# EAGLE design Phone_EE445L (EAGLE 9.5.1)

## Sheet 1 of 4
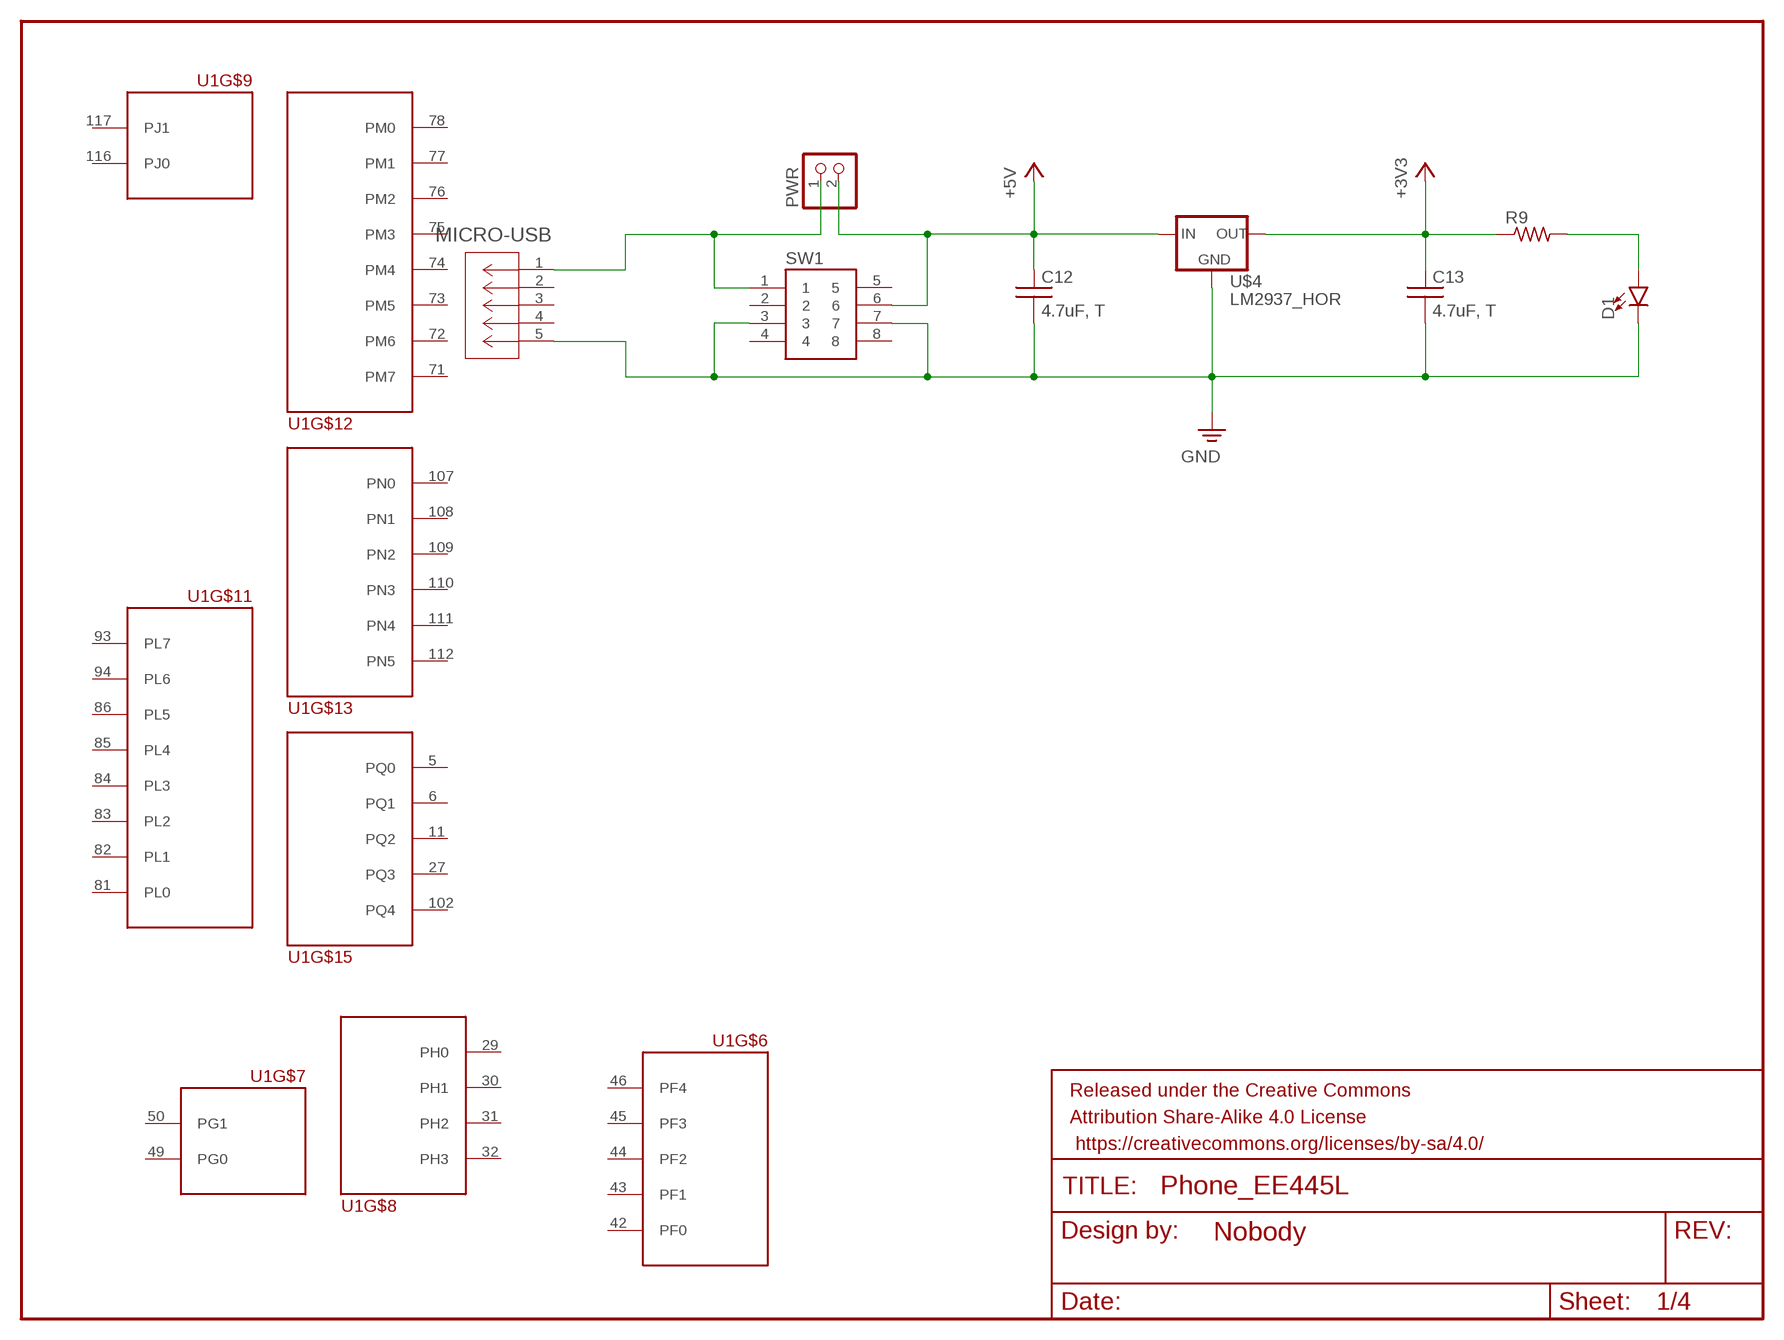
[diagram p0: schematic, sheet 1]

### Parts
C12  4.7uF, T  CAPACITOR050-024X044  [CAP200MIL]
C13  4.7uF, T  CAPACITOR050-024X044  [CAP200MIL]
D1  LED0603  [LED-0603]
FRAME1  FRAME-LETTERNO_PACKAGE  [DUMMY]
MICRO-USB  ZX62D-B-5PA8(30)  [CONN5_ZX62D-B-5PA8]
PWR  PINHD-1X2  [1X02]
R9  R-US_R0805  [R0805]
SW1  PUSHBUTTON  [PWRBUTTON]
U1  TM4C129-MOD  [TQFP-128]
U$4  LM2937_HOR  [TO220]

### Nets
5VIN: MICRO-USB.1 PWR.1 SW1.1
+3V3: C13.1 R9.1 U$4.3(OUT) ; also sheet 2,3,4
+5V: C12.1 PWR.2 SW1.6 U$4.1(IN) ; also sheet 3,4
GND: C12.2 C13.2 D1.C MICRO-USB.5 SW1.3 SW1.7 U$4.2(GND) ; also sheet 2,3,4
N$10: D1.A R9.2
Unconnected: MICRO-USB.2 MICRO-USB.3 MICRO-USB.4 SW1.2 SW1.4 SW1.5 SW1.8 U1.5(PQ0) U1.6(PQ1) U1.11(PQ2) U1.27(PQ3) U1.29(PH0) U1.30(PH1) U1.31(PH2) U1.32(PH3) U1.42(PF0) U1.43(PF1) U1.44(PF2) U1.45(PF3) U1.46(PF4) U1.49(PG0) U1.50(PG1) U1.71(PM7) U1.72(PM6) U1.73(PM5) U1.74(PM4) U1.75(PM3) U1.76(PM2) U1.77(PM1) U1.78(PM0) U1.81(PL0) U1.82(PL1) U1.83(PL2) U1.84(PL3) U1.85(PL4) U1.86(PL5) U1.93(PL7) U1.94(PL6) U1.102(PQ4) U1.107(PN0) U1.108(PN1) U1.109(PN2) U1.110(PN3) U1.111(PN4) U1.112(PN5) U1.116(PJ0) U1.117(PJ1)

## Sheet 2 of 4
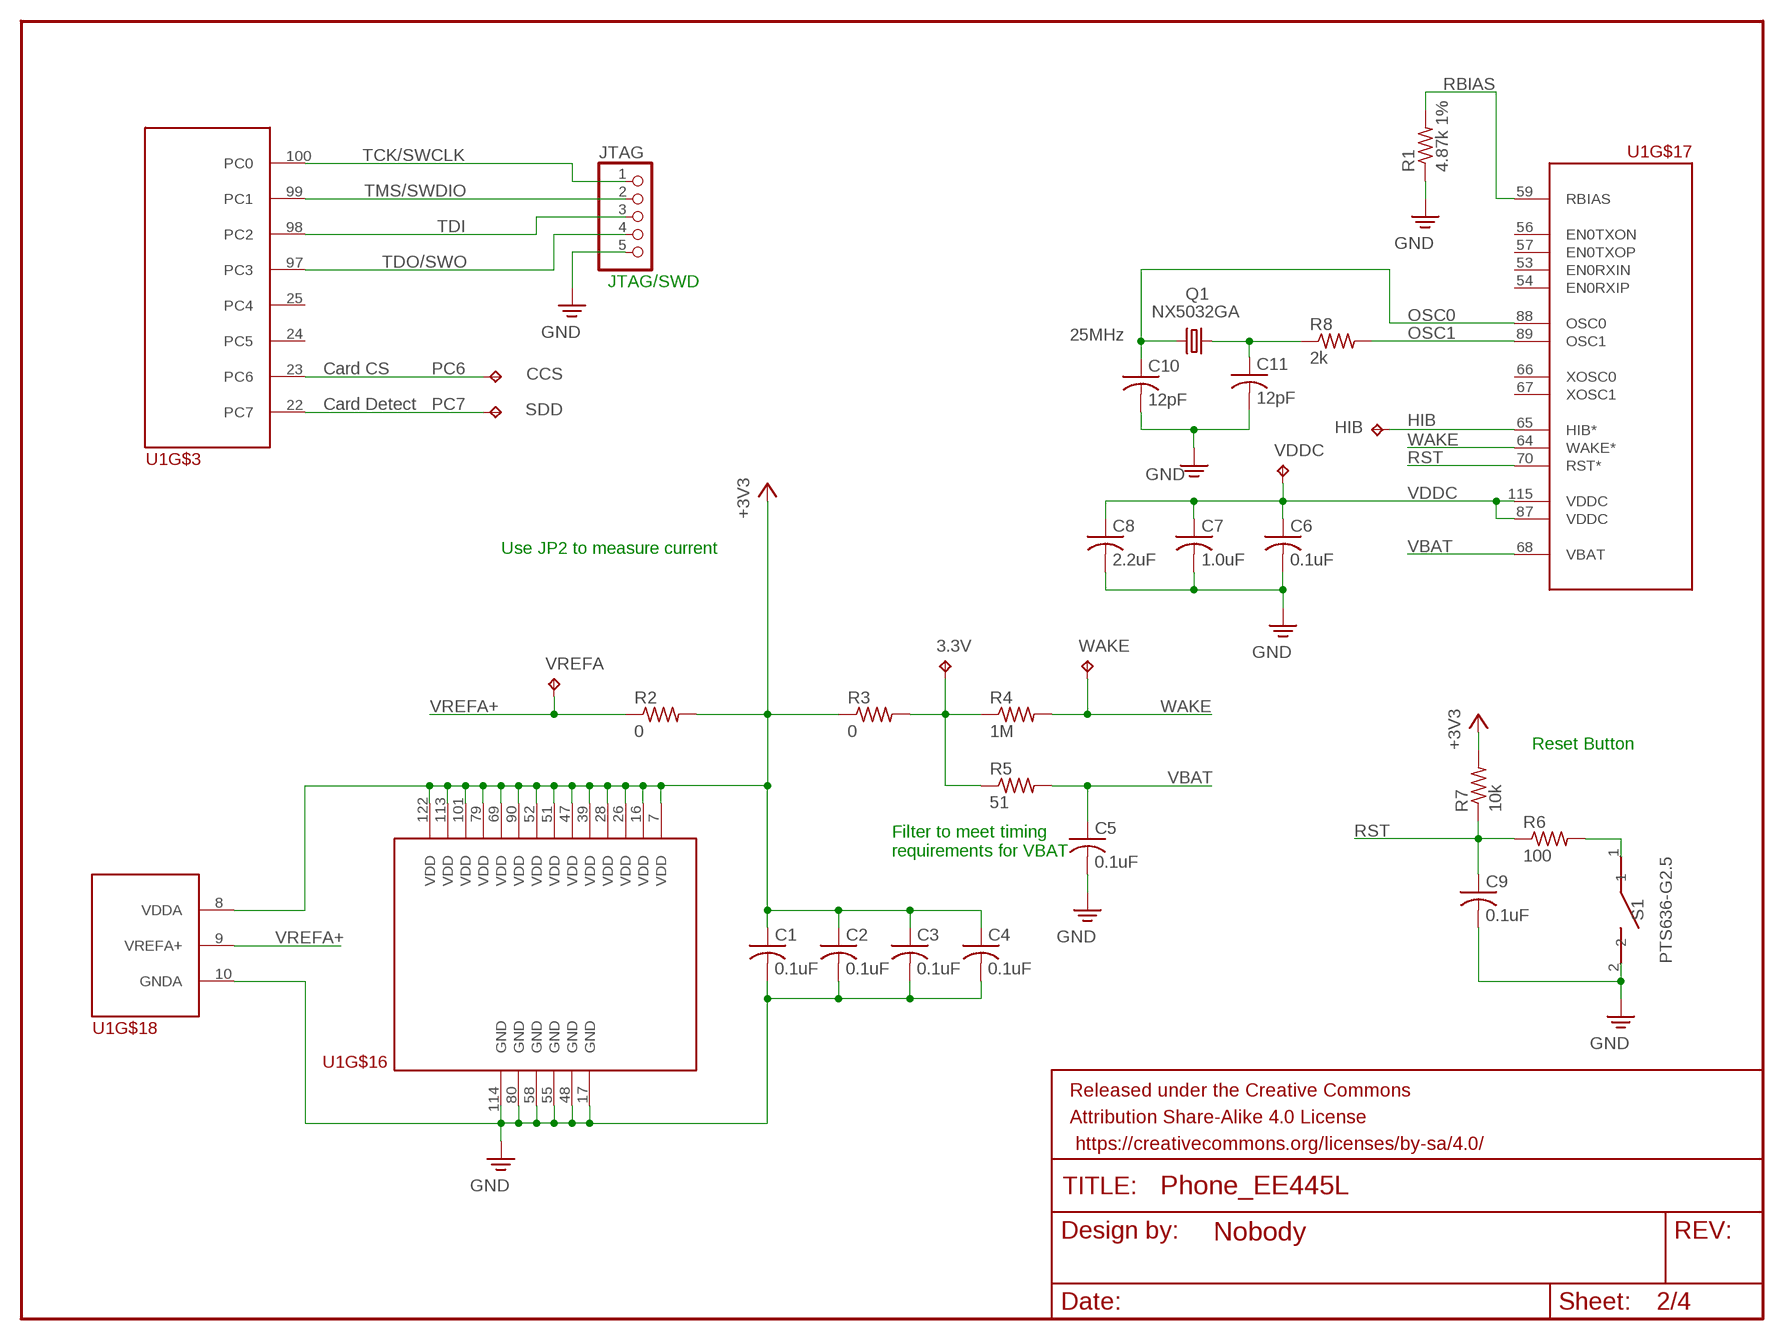
[diagram p1: schematic, sheet 2]

### Parts
3.3V  TP_KEYSTONE500X  [P1.1MM]
C1  0.1uF  C-USC0805  [C0805]
C2  0.1uF  C-USC0805  [C0805]
C3  0.1uF  C-USC0805  [C0805]
C4  0.1uF  C-USC0805  [C0805]
C5  0.1uF  C-USC0805  [C0805]
C6  0.1uF  C-USC0805  [C0805]
C7  1.0uF  C-USC0805  [C0805]
C8  2.2uF  C-USC0805  [C0805]
C9  0.1uF  C-USC0805  [C0805]
C10  12pF  C-USC0805  [C0805]
C11  12pF  C-USC0805  [C0805]
CCS  TP_KEYSTONE500X  [P1.1MM]
FRAME2  FRAME-LETTERNO_PACKAGE  [DUMMY]
HIB  TP_KEYSTONE500X  [P1.1MM]
JTAG  PINHD-1X5  [1X05]
Q1  NX5032GA  [NX5032GA]
R1  4.87k 1%  R-US_R0805  [R0805]
R2  0  R-US_R0805  [R0805]
R3  0  R-US_R0805  [R0805]
R4  1M  R-US_R0805  [R0805]
R5  51  R-US_R0805  [R0805]
R6  100  R-US_R0805  [R0805]
R7  10k  R-US_R0805  [R0805]
R8  2k  R-US_R0805  [R0805]
S1  PTS636-G2.5  [PTS636-G]
SDD  TP_KEYSTONE500X  [P1.1MM]
VDDC  TP_KEYSTONE500X  [P1.1MM]
VREFA  TP_KEYSTONE500X  [P1.1MM]
WAKE  TP_KEYSTONE500X  [P1.1MM]

### Nets
+3V3: C1.1 C2.1 C3.1 C4.1 R2.2 R3.1 R7.2 U1.7(VDD) U1.8(VDDA) U1.16(VDD) U1.26(VDD) U1.28(VDD) U1.39(VDD) U1.47(VDD) U1.51(VDD) U1.52(VDD) U1.69(VDD) U1.79(VDD) U1.90(VDD) U1.101(VDD) U1.113(VDD) U1.122(VDD) ; also sheet 1,3,4
GND: C1.2 C2.2 C3.2 C4.2 C5.2 C6.2 C7.2 C8.2 C9.2 C10.2 C11.2 JTAG.5 R1.1 S1.2 U1.10(GNDA) U1.17(GND) U1.48(GND) U1.55(GND) U1.58(GND) U1.80(GND) U1.114(GND) ; also sheet 1,3,4
HIB: HIB.TP U1.65(HIB*)
N$1: C11.1 Q1.1 R8.1
N$2: R6.2 S1.1
OSC0: C10.1 Q1.2 U1.88(OSC0)
OSC1: R8.2 U1.89(OSC1)
PC6: CCS.TP U1.23(PC6) ; also sheet 3
PC7: SDD.TP U1.22(PC7) ; also sheet 3
RBIAS: R1.2 U1.59(RBIAS)
RST: C9.1 R6.1 R7.1 U1.70(RST*)
TCK/SWCLK: JTAG.1 U1.100(PC0)
TDI: JTAG.3 U1.98(PC2)
TDO/SWO: JTAG.4 U1.97(PC3)
TMS/SWDIO: JTAG.2 U1.99(PC1)
VBAT: C5.1 R5.2 U1.68(VBAT)
VDDC: C6.1 C7.1 C8.1 U1.87(VDDC) U1.115(VDDC) VDDC.TP
VREFA+: R2.1 U1.9(VREFA+) VREFA.TP
WAKE: R4.2 U1.64(WAKE*) WAKE.TP
WAKEVDD: 3.3V.TP R3.2 R4.1 R5.1
Unconnected: U1.24(PC5) U1.25(PC4) U1.53(EN0RXIN) U1.54(EN0RXIP) U1.56(EN0TXON) U1.57(EN0TXOP) U1.66(XOSC0) U1.67(XOSC1)

### Notes on the sheet
- JTAG/SWD
- 25MHz
- Card CS
- Card Detect
- Use JP2 to measure current
- Reset Button
- Filter to meet timing
  requirements for VBAT

## Sheet 3 of 4
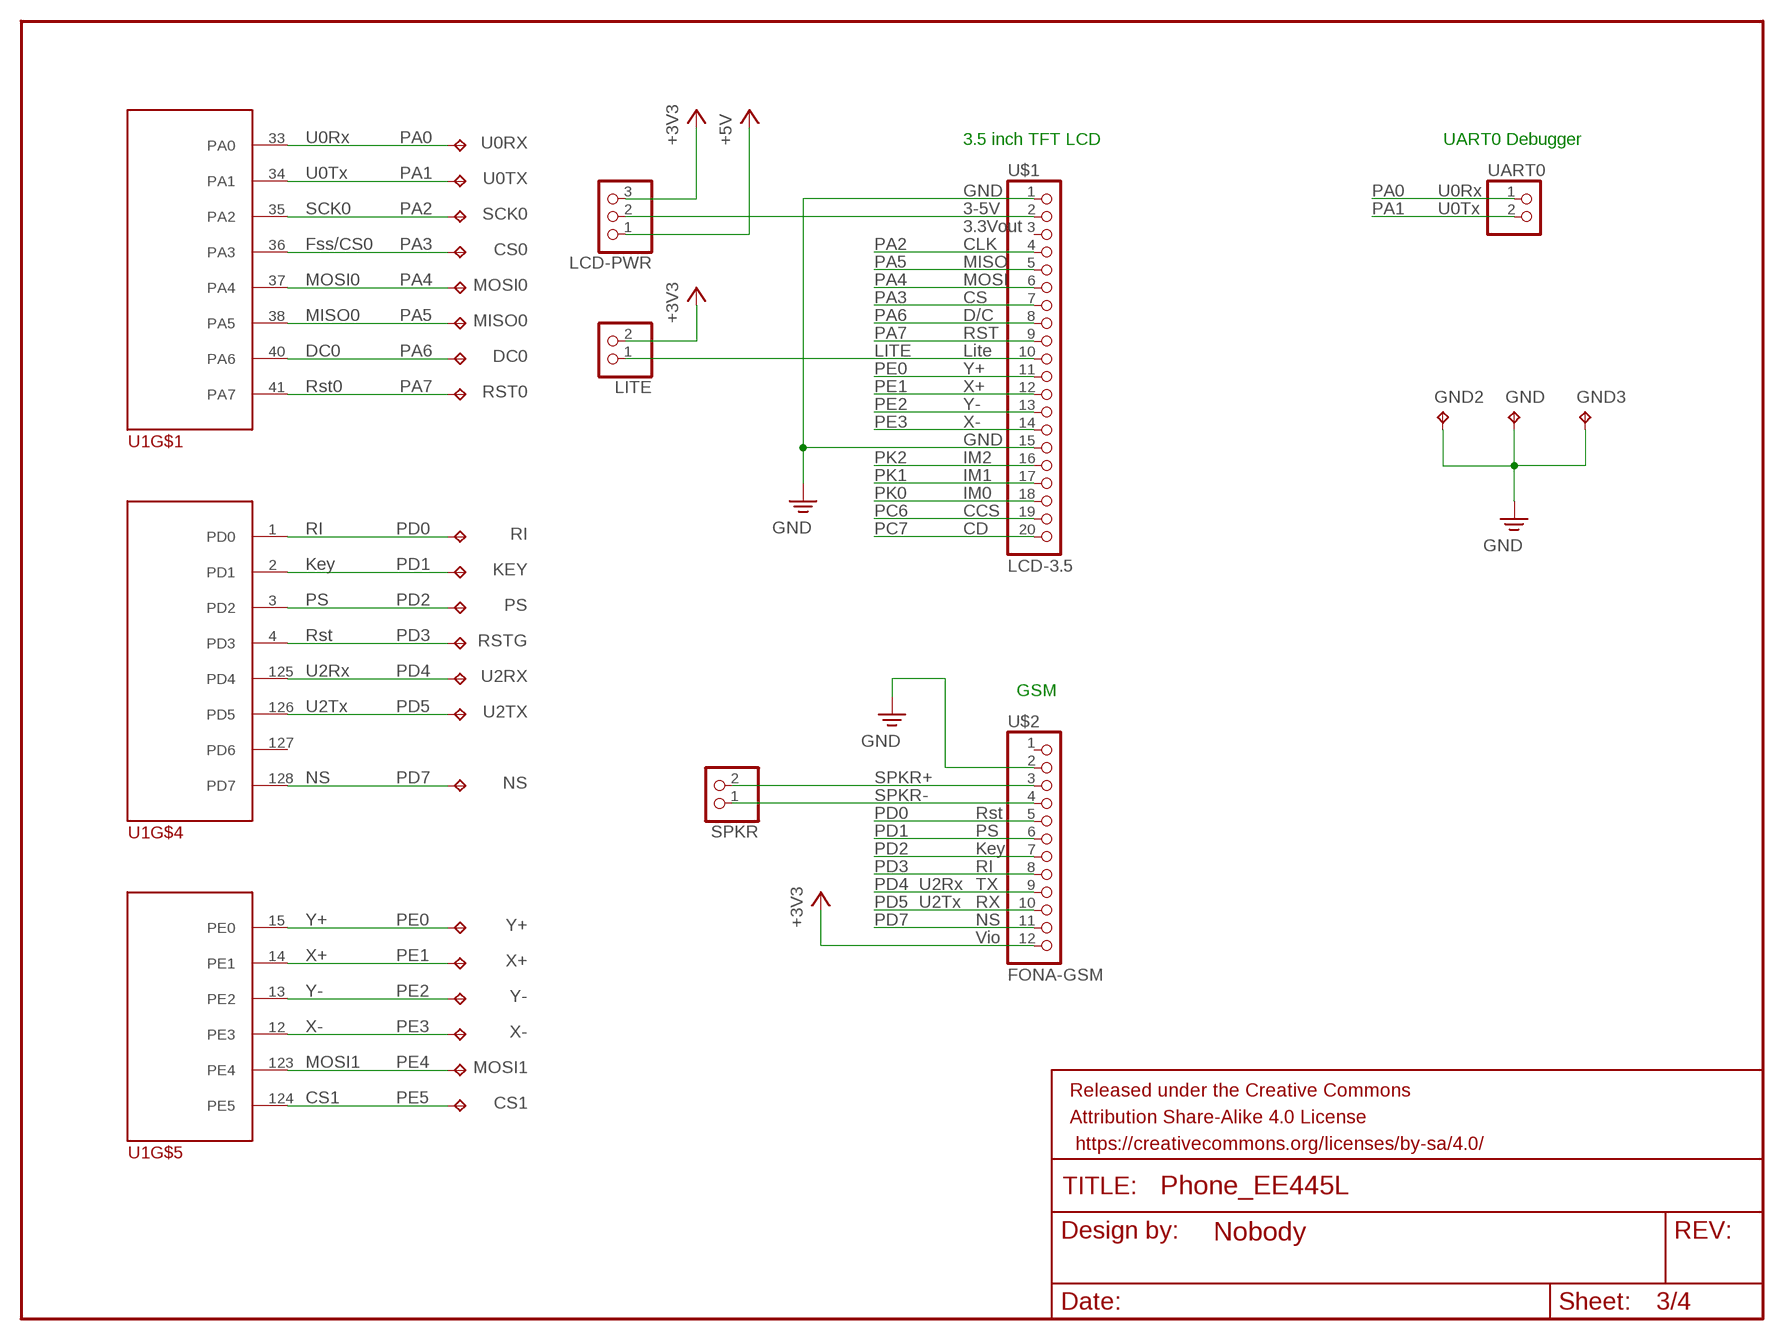
[diagram p2: schematic, sheet 3]

### Parts
CS0  TP_KEYSTONE500X  [P1.1MM]
CS1  TP_KEYSTONE500X  [P1.1MM]
DC0  TP_KEYSTONE500X  [P1.1MM]
FRAME3  FRAME-LETTERNO_PACKAGE  [DUMMY]
GND  TP_KEYSTONE500X  [P1.1MM]
GND2  TP_KEYSTONE500X  [P1.1MM]
GND3  TP_KEYSTONE500X  [P1.1MM]
KEY  TP_KEYSTONE500X  [P1.1MM]
LCD-PWR  PINHD-1X3  [1X03]
LITE  PINHD-1X2  [1X02]
MISO0  TP_KEYSTONE500X  [P1.1MM]
MOSI0  TP_KEYSTONE500X  [P1.1MM]
MOSI1  TP_KEYSTONE500X  [P1.1MM]
NS  TP_KEYSTONE500X  [P1.1MM]
PS  TP_KEYSTONE500X  [P1.1MM]
RI  TP_KEYSTONE500X  [P1.1MM]
RST0  TP_KEYSTONE500X  [P1.1MM]
RSTG  TP_KEYSTONE500X  [P1.1MM]
SCK0  TP_KEYSTONE500X  [P1.1MM]
SPKR  PINHD-1X2  [1X02]
U0RX  TP_KEYSTONE500X  [P1.1MM]
U0TX  TP_KEYSTONE500X  [P1.1MM]
U2RX  TP_KEYSTONE500X  [P1.1MM]
U2TX  TP_KEYSTONE500X  [P1.1MM]
U$1  LCD-3.5  [LCD3.5IN]
U$2  FONA-GSM  [FONA]
UART0  PINHD-1X2  [1X02]
X+  TP_KEYSTONE500X  [P1.1MM]
X-  TP_KEYSTONE500X  [P1.1MM]
Y+  TP_KEYSTONE500X  [P1.1MM]
Y-  TP_KEYSTONE500X  [P1.1MM]

### Nets
+3V3: LCD-PWR.3 LITE.2 U$2.12 ; also sheet 1,2,4
+5V: LCD-PWR.1 ; also sheet 1,4
GND: GND2.TP GND3.TP GND.TP U$1.1 U$1.15 U$2.2 ; also sheet 1,2,4
LCDPWR: LCD-PWR.2 U$1.2
LITE: LITE.1 U$1.10
PA0: U0RX.TP U1.33(PA0) UART0.1
PA1: U0TX.TP U1.34(PA1) UART0.2
PA2: SCK0.TP U1.35(PA2) U$1.4
PA3: CS0.TP U1.36(PA3) U$1.7
PA4: MOSI0.TP U1.37(PA4) U$1.6
PA5: MISO0.TP U1.38(PA5) U$1.5
PA6: DC0.TP U1.40(PA6) U$1.8
PA7: RST0.TP U1.41(PA7) U$1.9
PC6: U$1.19 ; also sheet 2
PC7: U$1.20 ; also sheet 2
PD0: RI.TP U1.1(PD0) U$2.5
PD1: KEY.TP U1.2(PD1) U$2.6
PD2: PS.TP U1.3(PD2) U$2.7
PD3: RSTG.TP U1.4(PD3) U$2.8
PD4: U1.125(PD4) U2RX.TP U$2.9
PD5: U1.126(PD5) U2TX.TP U$2.10
PD7: NS.TP U1.128(PD7) U$2.11
PE0: U1.15(PE0) U$1.11 Y+.TP
PE1: U1.14(PE1) U$1.12 X+.TP
PE2: U1.13(PE2) U$1.13 Y-.TP
PE3: U1.12(PE3) U$1.14 X-.TP
PE4: MOSI1.TP U1.123(PE4) ; also sheet 4
PE5: CS1.TP U1.124(PE5) ; also sheet 4
PK0: U$1.18
PK1: U$1.17
PK2: U$1.16
SPKR+: SPKR.2 U$2.3
SPKR-: SPKR.1 U$2.4
Unconnected: U1.127(PD6) U$1.3 U$2.1

### Notes on the sheet
- U0Rx | 3.5 inch TFT LCD | UART0 Debugger
- U0Tx
- GND | U0Rx
- SCK0 | 3-5V | U0Tx
- 3.3Vout
- Fss/CS0 | CLK
- MISO
- MOSI0 | MOSI
- CS
- MISO0 | D/C
- RST
- DC0 | Lite
- Y+
- Rst0 | X+
- Y-
- X-
- GND
- IM2
- IM1
- IM0
- CCS
- RI | CD
- Key
- PS
- Rst
- U2Rx
- GSM
- U2Tx
- NS
- Rst
- PS
- Key
- RI
- U2Rx | TX
- U2Tx | RX
- Y+ | NS
- Vio
- X+
- Y-
- X-
- MOSI1
- CS1

## Sheet 4 of 4
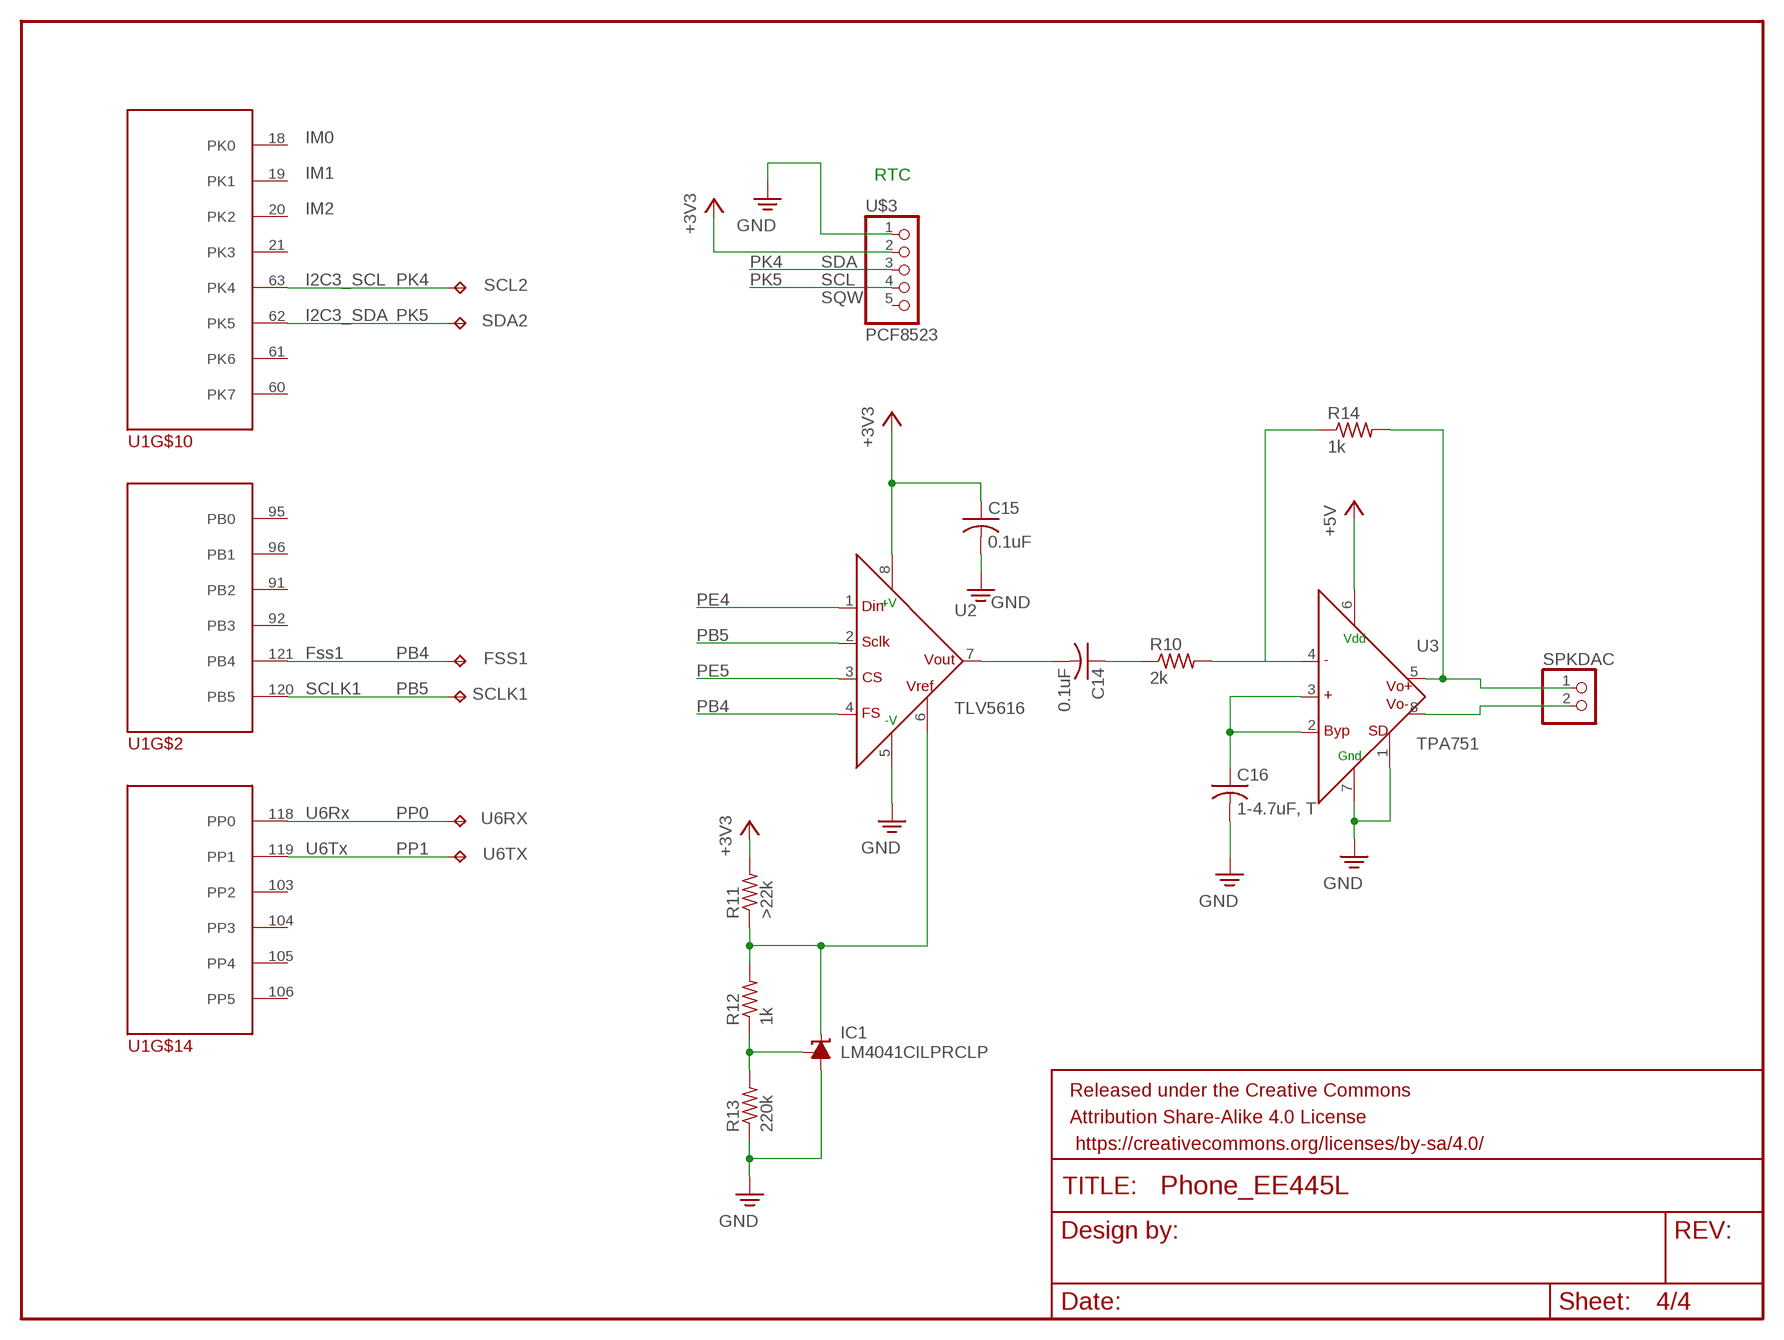
[diagram p3: schematic, sheet 4]

### Parts
C14  0.1uF  C-USC0805  [C0805]
C15  0.1uF  C-USC0805  [C0805]
C16  1-4.7uF, T  C-USC0805  [C0805]
FRAME4  FRAME-LETTERNO_PACKAGE  [DUMMY]
FSS1  TP_KEYSTONE500X  [P1.1MM]
IC1  LM4041CILPRCLP  [LP_O-PBCY-W3]
R10  2k  R-US_R0805  [R0805]
R11  >22k  R-US_R0805  [R0805]
R12  1k  R-US_R0805  [R0805]
R13  220k  R-US_R0805  [R0805]
R14  1k  R-US_R0805  [R0805]
SCL2  TP_KEYSTONE500X  [P1.1MM]
SCLK1  TP_KEYSTONE500X  [P1.1MM]
SDA2  TP_KEYSTONE500X  [P1.1MM]
SPKDAC  PINHD-1X2  [1X02]
U2  TLV5616  [DIL08]
U3  TPA751  [SO08]
U6RX  TP_KEYSTONE500X  [P1.1MM]
U6TX  TP_KEYSTONE500X  [P1.1MM]
U$3  PCF8523  [PCF8523]

### Nets
+3V3: C15.1 R11.2 U2.8(VDD) U$3.2 ; also sheet 1,2,3
+5V: U3.6(VDD) ; also sheet 1,3
AMPIN: R10.2 R14.1 U3.4(IN-)
DACOUT: C14.2 U2.7(OUT)
GND: C15.2 C16.2 IC1.3(A) R13.1 U2.5(AGND) U3.1(SHUTDOWN) U3.7(GND) U$3.1 ; also sheet 1,2,3
HPF: C14.1 R10.1
N$5: R14.2 SPKDAC.1 U3.5(VO+)
N$7: SPKDAC.2 U3.8(VO-)
N$16: C16.1 U3.2(BYPASS) U3.3(IN+)
PB4: FSS1.TP U1.121(PB4) U2.4(FS)
PB5: SCLK1.TP U1.120(PB5) U2.2(SCLK)
PE4: U2.1(DIN) ; also sheet 3
PE5: U2.3(CS) ; also sheet 3
PK4: SCL2.TP U1.63(PK4) U$3.3
PK5: SDA2.TP U1.62(PK5) U$3.4
PP0: U1.118(PP0) U6RX.TP
PP1: U1.119(PP1) U6TX.TP
SHUNT: IC1.1(FB) R12.1 R13.2
VREF: IC1.2(C) R11.1 R12.2 U2.6(REFIN)
Unconnected: U1.18(PK0) U1.19(PK1) U1.20(PK2) U1.21(PK3) U1.60(PK7) U1.61(PK6) U1.91(PB2) U1.92(PB3) U1.95(PB0) U1.96(PB1) U1.103(PP2) U1.104(PP3) U1.105(PP4) U1.106(PP5) U$3.5

### Notes on the sheet
- IM0
- IM1 | RTC
- IM2
- SDA
- I2C3_SCL | SCL
- SQW
- I2C3_SDA
- Fss1
- SCLK1
- U6Rx
- U6Tx

## Library data of the parts
3.3V CCS CS0 CS1 DC0 FSS1 GND GND2 GND3 HIB KEY MISO0 MOSI0 MOSI1 NS PS RI RST0 RSTG SCK0 SCL2 SCLK1 SDA2 SDD U0RX U0TX U2RX U2TX U6RX U6TX VDDC VREFA WAKE X+ X- Y+ Y- = EE445L:TP: Test pad Test point, black, Keystone Electronics 5001, Digikey 5001K-ND Test point, orange, Keystone Electronics 5003, Digikey 5003K-ND Test point, yellow, Keystone Electronics 5004, Digikey 5004K-ND Test point, white, Keystone Electronics 5002, Digikey 5002K-ND Test point, red, Keystone Electronics 5000, Digikey 5000K-ND
C1-C11 C14-C16 = rcl:C-US: CAPACITOR, American symbol; SPICEPREFIX: C
C12 C13 = EE445L:CAPACITOR: CAPACITOR, American symbol
D1 = SparkFun-LED:LED: LED (Generic) Standard schematic elements and footprints for 5mm, 3mm, 1206, and 0603 sized LEDs. Generic LEDs with no color specified.
FRAME1-FRAME4 = SparkFun-Aesthetics:FRAME-LETTER: Schematic Frame - Letter Standard 8.5x11 US Letter frame; DESIGNER: Nobody; VERSION: v01
IC1 = EE445L:LM4041CILPR: PRECISION MICROPOWER SHUNT VOLTAGE REFERENCE Adjustable Output Source: http://focus.ti.com/lit/ds/slcs146e/slcs146e.pdf LM4041CILPR Let R1 be the resistor from Vref to +3.3V Let R2 be the resistor from Vref to FB Let R3 be the resistor from FB to ground Vref = 1.23*(1+R3/R2) Iref=(3.3V-Vref)/R1 - 100uA; MPN: LM4041CILP; OC_FARNELL: 1673945; OC_NEWARK: 50M8856
JTAG = EE445L:PINHD-1X5: PIN HEADER
LCD-PWR = EE445L:PINHD-1X3: PIN HEADER
LITE PWR SPKDAC SPKR UART0 = EE445L:PINHD-1X2: PIN HEADER
MICRO-USB = EE445L:ZX62D-B-5PA8(30); MANUFACTURER_PART_NUMBER: ZX62DB5PA830; VENDOR: Hirose
Q1 = EE445L:NX5032GA: 16 MHz Crystal 4mm SMD Digikey NX5032GA-16.000000; OC_FARNELL: unknown; OC_NEWARK: unknown
R1-R14 = rcl:R-US_: RESISTOR, American symbol; SPICEPREFIX: R
S1 = EE445L:PTS636-G2.5
SW1 = EE445L:PUSHBUTTON
U1 = EE445L:TM4C129-MOD
U2 = EE445L:TLV5616: TLV5616 12-bit DAC SSI digital input, one analog output Vout = (2*n*Vref)/4096
U3 = EE445L:TPA751: TPA751D The TPA751 is a bridge-tied load (BTL) audio power amplifier developed especially for low-voltage applications where internal speakers are required. Operating with a 3.3-V supply, the TPA751 can deliver 250-mW of continuous power into a BTL 8-Ω load at less than 0.6% THD+N throughout voice band frequencies. Although this device is characterized out to 20 kHz, its operation is optimized for narrower band applications such as wireless communications. The BTL configuration eliminates the need for external coupling capacitors on the output in most applications, which is particularly important for small battery-powered equipment. This device features a shutdown mode for power-sensitive applications with a supply current of 1.5 nA during shutdown. This part could be used for other mono channel headphone amps like the TPA321 or TPA731.
U$1 = EE445L:LCD-3.5
U$2 = EE445L:FONA-GSM
U$3 = EE445L:PCF8523
U$4 = EE445L:LM2937_HOR: LM2937 Horizontal mount 2.5-V and 3.3-V 400-mA and 500-mA Voltage Regulators

## Board
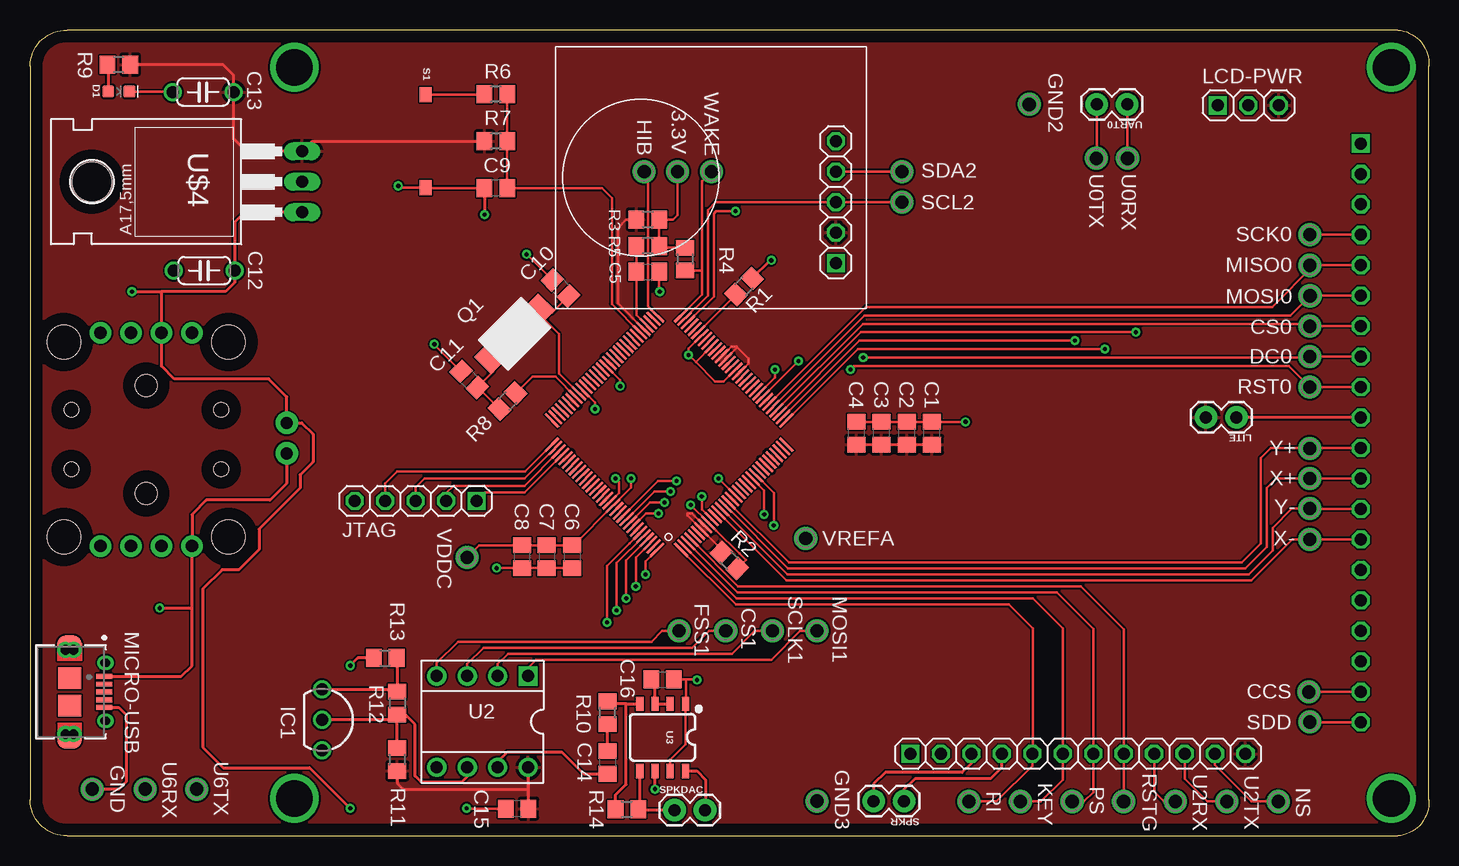
[diagram p4: board, top side]
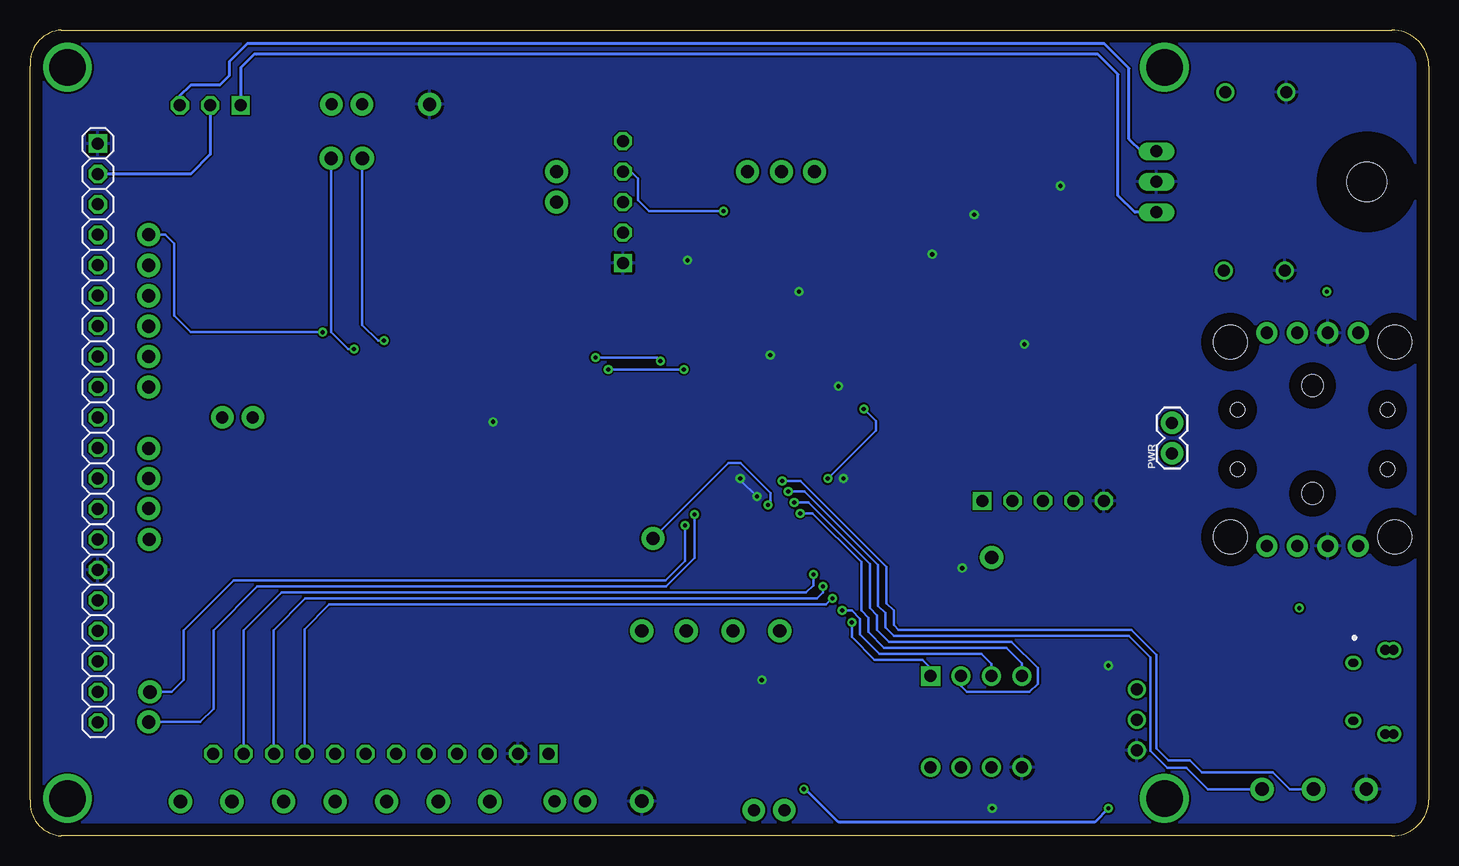
[diagram p5: board, bottom side, seen from below]

Size 116.61 x 67.2 mm. Coordinates in mm from the lower left corner, seen from the top.
Outline: 3.1,0 114,0 arc90 116.6,3 116.6,64.2 arc90 114,67.2 3.1,67.2 arc90 0,64.2 0,3 arc90 3.1,0
Copper layers (1*16): Top 0.035mm / dielectric 1.5mm / Bottom 0.035mm
Design rules "default": minimum track width 6mil, minimum drill 0.35mm, track to track 6mil, track to pad 6mil, pad to pad 6mil, via to via 6mil, smd to smd 6mil, copper to edge 40mil, drill to drill 6mil, minimum pad ring 10mil, minimum via ring 8mil, stop-mask expansion 4mil, vias tented up to drill 0mil, thermal gap 10mil

### Footprints (pad centres in the part's own frame; a part is rotated, then mirrored left to right if it is on the bottom)
P1.1MM = drill 1.1 pad 1.93: TP 0,0
C0805 = smd 1.3 x 1.5: 1 -0.95,0; 2 0.95,0
CAP200MIL = drill 1: 1 -2.54,0; 2 2.54,0
LED-0603 = smd 1 x 1: A -0.877,0; C 0.877,0
LP_O-PBCY-W3 = drill 1 pad 1.4: 1 -2.54,0; 2 0,0; 3 2.54,0
1X05 = drill 1 square: 1 -5.08,0 | drill 1 octagon: 2 -2.54,0; 3 0,0; 4 2.54,0; 5 5.08,0
1X03 = drill 1 square: 1 -2.54,0 | drill 1 octagon: 2 0,0; 3 2.54,0
1X02 = drill 1 pad 1.88: 1 0,0; 2 2.54,0
CONN5_ZX62D-B-5PA8 = smd 0.406 x 1.346: 1 -2.6,0; 2 -1.95,0; 3 -1.3,0; 4 -0.65,0; 5 0,0 | smd 1.168 x 1.346: 6 -3.725,0.1; 7 1.125,0.1 | smd 1.321 x 2.007: 8 -5.34,-2.9; 9 2.74,-2.9 | smd 1.803 x 1.905: 10 -2.45,-2.9; 11 -0.15,-2.9 | drill 0.66 pad 0.66: 12 -3.734,0.178; 13 -3.734,0; 14 1.118,0.178; 15 1.118,0 | drill 0.813 pad 0.813: 16 -4.801,-2.565; 17 -4.801,-3.251; 18 2.21,-2.565; 19 2.21,-3.251
NX5032GA = smd 2.54 x 2: 1 -2.5,0; 2 2.5,0
R0805 = smd 1.3 x 1.5: 1 -0.95,0; 2 0.95,0
PTS636-G = smd 1.25 x 1: 1 -3.875,0; 2 3.875,0
PWRBUTTON = drill 1.016 pad 1.778: 1 1.27,12.7; 2 1.27,10.16; 3 1.27,7.62; 4 1.27,5.08; 5 19.05,12.7; 6 19.05,10.16; 7 19.05,7.62; 8 19.05,5.08 | hole 2.8: 2.032,15.748; 2.032,2.032; 18.288,15.748; 18.288,2.032 | hole 1.803: 14.656,8.89; 5.664,8.89 | hole 1.194: 12.649,15.138; 7.671,15.138; 7.671,2.642; 12.649,2.642
TQFP-128 = smd 1.564 x 0.189: 1 -7.62,6.2; 2 -7.62,5.8; 3 -7.62,5.4; 4 -7.62,5; 5 -7.62,4.6; 6 -7.62,4.2; 7 -7.62,3.8; 8 -7.62,3.4; 9 -7.62,3; 10 -7.62,2.6; 11 -7.62,2.2; 12 -7.62,1.8; 13 -7.62,1.4; 14 -7.62,1; 15 -7.62,0.6; 16 -7.62,0.2; 17 -7.62,-0.2; 18 -7.62,-0.6; 19 -7.62,-1; 20 -7.62,-1.4; 21 -7.62,-1.8; 22 -7.62,-2.2; 23 -7.62,-2.6; 24 -7.62,-3; 25 -7.62,-3.4; 26 -7.62,-3.8; 27 -7.62,-4.2; 28 -7.62,-4.6; 29 -7.62,-5; 30 -7.62,-5.4; 31 -7.62,-5.8; 32 -7.62,-6.2; 65 7.62,-6.2; 66 7.62,-5.8; 67 7.62,-5.4; 68 7.62,-5; 69 7.62,-4.6; 70 7.62,-4.2; 71 7.62,-3.8; 72 7.62,-3.4; 73 7.62,-3; 74 7.62,-2.6; 75 7.62,-2.2; 76 7.62,-1.8; 77 7.62,-1.4; 78 7.62,-1; 79 7.62,-0.6; 80 7.62,-0.2; 81 7.62,0.2; 82 7.62,0.6; 83 7.62,1; 84 7.62,1.4; 85 7.62,1.8; 86 7.62,2.2; 87 7.62,2.6; 88 7.62,3; 89 7.62,3.4; 90 7.62,3.8; 91 7.62,4.2; 92 7.62,4.6; 93 7.62,5; 94 7.62,5.4; 95 7.62,5.8; 96 7.62,6.2 | smd 0.189 x 1.564: 33 -6.2,-7.62; 34 -5.8,-7.62; 35 -5.4,-7.62; 36 -5,-7.62; 37 -4.6,-7.62; 38 -4.2,-7.62; 39 -3.8,-7.62; 40 -3.4,-7.62; 41 -3,-7.62; 42 -2.6,-7.62; 43 -2.2,-7.62; 44 -1.8,-7.62; 45 -1.4,-7.62; 46 -1,-7.62; 47 -0.6,-7.62; 48 -0.2,-7.62; 49 0.2,-7.62; 50 0.6,-7.62; 51 1,-7.62; 52 1.4,-7.62; 53 1.8,-7.62; 54 2.2,-7.62; 55 2.6,-7.62; 56 3,-7.62; 57 3.4,-7.62; 58 3.8,-7.62; 59 4.2,-7.62; 60 4.6,-7.62; 61 5,-7.62; 62 5.4,-7.62; 63 5.8,-7.62; 64 6.2,-7.62; 97 6.2,7.62; 98 5.8,7.62; 99 5.4,7.62; 100 5,7.62; 101 4.6,7.62; 102 4.2,7.62; 103 3.8,7.62; 104 3.4,7.62; 105 3,7.62; 106 2.6,7.62; 107 2.2,7.62; 108 1.8,7.62; 109 1.4,7.62; 110 1,7.62; 111 0.6,7.62; 112 0.2,7.62; 113 -0.2,7.62; 114 -0.6,7.62; 115 -1,7.62; 116 -1.4,7.62; 117 -1.8,7.62; 118 -2.2,7.62; 119 -2.6,7.62; 120 -3,7.62; 121 -3.4,7.62; 122 -3.8,7.62; 123 -4.2,7.62; 124 -4.6,7.62; 125 -5,7.62; 126 -5.4,7.62; 127 -5.8,7.62; 128 -6.2,7.62
DIL08 = drill 1 pad 1.6 square: 1 -3.81,-3.81 | drill 1 pad 1.6: 2 -1.27,-3.81; 3 1.27,-3.81; 4 3.81,-3.81; 5 3.81,3.81; 6 1.27,3.81; 7 -1.27,3.81; 8 -3.81,3.81
SO08 = smd 0.6 x 1.2: 1 -1.905,-2.8; 2 -0.635,-2.8; 3 0.635,-2.8; 4 1.905,-2.8; 5 1.905,2.8; 6 0.635,2.8; 7 -0.635,2.8; 8 -1.905,2.8
LCD3.5IN = drill 1 square: 1 -24.13,0 | drill 1 octagon: 2 -21.59,0; 3 -19.05,0; 4 -16.51,0; 5 -13.97,0; 6 -11.43,0; 7 -8.89,0; 8 -6.35,0; 9 -3.81,0; 10 -1.27,0; 11 1.27,0; 12 3.81,0; 13 6.35,0; 14 8.89,0; 15 11.43,0; 16 13.97,0; 17 16.51,0; 18 19.05,0; 19 21.59,0; 20 24.13,0 | drill 3.048 pad 4.064: P$1 -30.48,88.9; P$2 30.48,88.9; P$3 30.48,-2.54; P$4 -30.48,-2.54
FONA = drill 1 square: 1 -13.97,0 | drill 1 octagon: 2 -11.43,0; 3 -8.89,0; 4 -6.35,0; 5 -3.81,0; 6 -1.27,0; 7 1.27,0; 8 3.81,0; 9 6.35,0; 10 8.89,0; 11 11.43,0; 12 13.97,0
PCF8523 = drill 1 square: 1 -5.08,0 | drill 1 octagon: 2 -2.54,0; 3 0,0; 4 2.54,0; 5 5.08,0
TO220 = drill 1 long: 1 -2.54,-6.35; 2 0,-6.35; 3 2.54,-6.35 | hole 3.302: 0,11.176

### Placement (x,y rotation side)
3.3V  53.97,55.39 0 top
C1  75.19,33.57 90 top
C2  73.09,33.57 90 top
C3  70.99,33.57 90 top
C4  68.88,33.57 90 top
C5  51.5,47.04 0 top
C6  45.19,23.28 270 top
C7  43.08,23.28 270 top
C8  41,23.28 270 top
C9  38.83,54 180 top
C10  44.22,45.68 135 top
C11  36.61,38.06 135 top
C12  14.53,47.14 180 top
C13  14.43,62.02 180 top
C14  48.14,6.13 270 top
C15  40.6,2.27 180 top
C16  52.73,13.04 0 top
CCS  106.6,12 90 top
CS0  106.7,42.5 0 top
CS1  58,17.1 270 top
D1  7.4,62.07 0 top
DC0  106.7,39.96 0 top
FRAME1  0.1,0 0 top
FRAME2  0.1,-1.27 0 top
FRAME3  26.58,36.68 0 top
FRAME4  -39.84,-21.99 0 top  (outside the outline)
FSS1  54.1,17.1 270 top
GND  5.2,3.9 0 top
GND2  83.3,61 0 top
GND3  65.6,2.9 0 top
HIB  51.2,55.4 0 top
IC1  24.34,9.68 270 top
JTAG  32.15,27.93 180 top
KEY  82.57,2.87 90 top
LCD-PWR  101.57,60.91 0 top
LITE  100.57,34.9 180 top
MICRO-USB  6.2,10.71 270 top
MISO0  106.7,47.57 180 top
MOSI0  106.71,45.04 180 top
MOSI1  65.6,17.1 270 top
NS  104.07,2.87 90 top
PS  86.87,2.87 90 top
PWR  21.4,31.9 90 bottom
Q1  40.39,41.87 45 top
R1  59.53,45.82 225 top
R2  58.29,22.97 135 top
R3  51.5,51.4 0 top
R4  54.6,48.1 270 top
R5  51.5,49.2 180 top
R6  38.83,61.84 180 top
R7  38.83,57.92 180 top
R8  39.81,36.27 45 top
R9  7.4,64.31 180 top
R10  48.14,10.27 90 top
R11  30.61,6.37 270 top
R12  30.62,11.07 270 top
R13  29.61,14.83 0 top
R14  49.76,2.22 0 top
RI  78.27,2.87 90 top
RST0  106.7,37.42 0 top
RSTG  91.17,2.87 90 top
S1  32.97,57.91 270 top
SCK0  106.7,50.13 0 top
SCL2  72.7,52.85 0 top
SCLK1  61.9,17.1 270 top
SDA2  72.7,55.4 0 top
SDD  106.7,9.5 90 top
SPKDAC  53.73,2.14 0 top
SPKR  72.87,2.9 180 top
SW1  0.8,22.9 90 bottom
U0RX  91.5,56.5 270 top
U0TX  88.9,56.5 270 top
U1  53.28,33.63 135 top
U2  37.72,9.52 180 top
U2RX  95.47,2.87 90 top
U2TX  99.77,2.87 90 top
U3  52.73,8.21 180 top
U6RX  9.6,3.9 270 top
U6TX  13.9,3.9 270 top
U$1  110.94,33.61 270 bottom
U$2  87.36,6.85 0 top
U$3  67.18,52.85 90 top
U$4  16.34,54.54 90 top
UART0  91.47,61.01 180 top
VDDC  36.44,23.23 270 top
VREFA  64.67,24.81 0 top
WAKE  56.8,55.4 0 top
X+  106.7,29.8 0 top
X-  106.68,24.72 0 top
Y+  106.7,32.3 0 top
Y-  106.7,27.3 0 top

### Tracks (layer width: path | path; a pad name or v marks a point on that pad's centre or on a via)
5VIN  (via drill 0.35)
  Top 0.254: MICRO-USB.1 12.61,13.31 13.5,14.2 13.5,18.9 | 13.5,18.9 SW1.1 13.5,26.8 14.7,28 20,28 21.4,29.4 PWR.1 | v10.8,19 13.4,19 13.5,18.9
+3V3
  Top 0.2: U1.69 49,44.41 49,50.7 49.7,51.4 R3.1 | U1.8 55.2,26.9 54.8,26.9 54.8,26.74 U1.7 57.62,23.92 R2.2 | U1.52 58.47,40.8 58.9,40.8 58.95,40.75 | 58.95,40.75 59.9,39.8 59.9,39.4 U1.47 | 58.95,40.75 58.95,40.71 U1.51 | C1.1 C2.1 C3.1 C4.1
  Top 0.254: R11.2 30.61,4.39 31.1,3.9 41.53,3.9 | C15.1 41.53,2.29 41.53,3.9 | U2.8 41.53,3.9 | R9.1 16.09,64.31 16.97,63.43 C13.1 16.97,58.13 18.02,57.08 U$4.3 23.53,57.92 R7.2
  Bottom 0.254: U$4.3 23.98,57.08 25,58.1 25,64 27.06,66.06 98.5,66.06 100,64.56 100,63.4 100.79,62.61 103.21,62.61 104.11,61.71 LCD-PWR.3
  pour Top: 0,67.2 0,0 116.6,0 116.6,67.2
+5V  (via drill 0.35)
  Top 0.254: U$4.1 17.9,52 17.07,51.17 C12.1 17.1,47.11 17.1,46.2 16.3,45.4 10.96,45.4 | 10.96,45.4 SW1.6 10.96,39.18 12.04,38.1 19.9,38.1 21.4,36.6 PWR.2 22.66,34.44 23.6,33.5 23.6,31.2 22.5,30.1 22.5,29 19.09,25.59 19.09,23.88 17.41,22.2 16,22.2 14.4,20.6 14.4,7.4 16.1,5.7 23.29,5.7 v26.7,2.29 | v52.1,3.9 v52.09,3.9 U3.6 | v8.5,45.4 10.96,45.4
  Bottom 0.254: U$4.1 24.5,52 25.9,53.4 25.9,63.5 27.6,65.2 97.9,65.2 99.03,64.07 LCD-PWR.1 | v26.7,2.29 27.85,1.14 49.2,1.14 51.96,3.9 v52.1,3.9
AMPIN
  Top 0.254: 49.7,11.02 48.34,11.02 R10.2 | 49.7,11.02 50.82,11.02 U3.4 | R14.1 48.81,3.41 49.7,4.3 49.7,11.02
DACOUT
  Top 0.254: U2.7 38.99,6.19 39.78,6.98 44.34,6.98 46.14,5.18 C14.2
GND  (via drill 0.35)
  Top 0.2: U1.17 v57.4,29.79 v57.4,29.8 | U1.114 49.1,28.6 49.1,29.5 v48.8,29.8 | v55.6,13 55.56,13.04 C16.2 54.7,13.04 54.7,11.07 U3.1 54.63,7.63 53.37,6.37 U3.7 | C15.2 36.43,2.27 v36.4,2.3 | D1.C 11.84,62.07 C13.2 | v30.7,54.2 30.87,54.03 S1.2 33.01,54 C9.2 | C11.2 33.7,40.97 v33.7,41 | C10.2 v41.41,48.5 v41.4,48.5 | U1.80 49.2,37.99 v49.2,37.5 | U1.58 54.9,40.62 v54.9,40.1 55.5,39.5 | U1.48 57.83,37.9 57.1,37.9 55.5,39.5 | U1.55 55.5,39.53 55.5,39.5 | U1.10 56,27.23 v56,28.3 | C5.2 52.45,45.45 v52.5,45.4 | v78,34.53 v78,34.52 C1.2 C2.2 C3.2 C4.2 | C6.2 C7.2 C8.2 v38.9,22.33
  Top 0.254: v26.7,14.2 27.33,14.83 R13.1 | MICRO-USB.5 7.39,10.71 8,10.1 8,4.5 7.4,3.9 GND.TP | R1.1 61.71,48 v61.8,48 | C9.2 37.88,51.82 v37.9,51.8
  Bottom 0.2: v56,28.3 57.4,29.7 v57.4,29.8
  pour Bottom: -0.2,67.4 -0.2,-0.2 116.8,-0.2 116.8,67.4
HIB
  Top 0.2: U1.65 51.5,44.18 51.5,55.1 HIB.TP
HPF
  Top 0.254: C14.1 R10.1
LCDPWR
  Bottom 0.254: LCD-PWR.2 101.57,56.83 103.2,55.2 U$1.2
LITE
  Top 0.254: U$1.10 100.59,34.88 LITE.1
N$1
  Top 0.2: Q1.1 38.62,38.73 C11.1 37.34,37.39 R8.1
N$2
  Top 0.2: R6.2 37.83,61.78 S1.1
N$5
  Top 0.254: SPKDAC.1 50.79,2.14 R14.2 50.83,2.33 U3.5
N$7
  Top 0.254: U3.8 55.59,5.41 56.3,4.7 56.3,2.17 SPKDAC.2
N$10
  Top 0.254: R9.2 6.52,64.24 D1.A
N$16
  Top 0.254: U3.2 U3.3 52.09,12.72 C16.1
OSC0
  Top 0.2: C10.1 43.52,43.63 42.3,43.63 | 42.3,43.63 Q1.2 | U1.88 44.1,38.57 44.1,41.84 42.3,43.63
OSC1
  Top 0.2: R8.2 40.54,36.94 41.9,38.3 43.8,38.3 U1.89
PA0  (via drill 0.35)
  Top 0.2: U1.33 69.02,40.6 v89.6,40.6 | UART0.1 91.47,56.53 U0RX.TP
  Bottom 0.2: v89.6,40.6 90.1,40.6 91.5,42 U0RX.TP
PA1  (via drill 0.35)
  Top 0.2: U1.34 69.15,41.3 v87.1,41.3 | UART0.2 88.93,56.53 U0TX.TP
  Bottom 0.2: v87.1,41.3 87.6,41.3 88.9,42.6 U0TX.TP
PA2  (via drill 0.35)
  Top 0.2: U$1.4 SCK0.TP | v92.2,42 74.69,42 69.29,42 U1.35
  Bottom 0.2: v92.2,42 103.2,42 104.6,43.4 104.6,49.4 105.33,50.13 SCK0.TP
PA3
  Top 0.2: U$1.7 CS0.TP 106.5,42.7 69.42,42.7 U1.36
PA4
  Top 0.2: U$1.6 MOSI0.TP 105.06,43.39 69.54,43.39 U1.37
PA5
  Top 0.2: U$1.5 107.04,47.58 | 107.04,47.58 MISO0.TP | U1.38 69.69,44.1 103.56,44.1 107.04,47.58
PA6  (via drill 0.35)
  Top 0.2: U$1.8 DC0.TP 106.64,39.9 v69.46,39.9 | U1.40 v64.06,39.6
  Bottom 0.2: v64.06,39.6 64.36,39.9 v69.46,39.9
PA7  (via drill 0.35)
  Top 0.2: U$1.9 RST0.TP 104.92,39.2 68.7,39.2 v68.4,38.9 | U1.41 62.1,38.21 v62.1,38.9
  Bottom 0.2: v62.1,38.9 v68.4,38.9
PB4  (via drill 0.35)
  Top 0.2: U1.121 51.36,26.9 v52.4,26.9 | U2.4 33.91,14.41 35.7,16.2 51.8,16.2 52.7,17.1 FSS1.TP
  Bottom 0.2: v52.4,26.9 51.36,26.9 47.3,22.84 47.3,18.8 46.7,18.2 46.7,17 45.4,15.7 35.2,15.7 33.9,14.4 U2.4
PB5  (via drill 0.35)
  Top 0.2: U1.120 51.69,27.8 v52.9,27.8 | U2.2 38.99,14.33 39.86,15.2 58.5,15.2 60.4,17.1 SCLK1.TP
  Bottom 0.2: v52.9,27.8 51.7,27.8 46.6,22.7 46.6,19 46,18.4 46,17.2 45,16.2 34.8,16.2 32.6,14 32.6,12.7 33.3,12 38.5,12 39,12.5 U2.2
PC6  (via drill 0.35)
  Top 0.2: U$1.19 106.62,12.02 CCS.TP | U1.23 62,28.59 v62,25.9
  Bottom 0.2: v62,25.9 62,22.93 63.63,21.3 99.64,21.3 103.8,17.14 103.8,13 104.8,12 CCS.TP
PC7  (via drill 0.35)
  Top 0.2: U$1.20 106.72,9.48 SDD.TP | U1.22 61.2,28.82 v61.2,26.8
  Bottom 0.2: v61.2,26.8 61.2,23.17 63.57,20.8 97.65,20.8 101.3,17.15 101.3,10.6 102.4,9.5 SDD.TP
PD0
  Top 0.2: RI.TP 80.57,2.87 83.55,5.85 U$2.5 83.6,6.9 83.6,17.3 81.6,19.3 58.84,19.3 U1.1
PD1
  Top 0.2: KEY.TP 84.27,2.87 86.09,4.69 U$2.6 86.09,17.31 83.6,19.8 58.91,19.8 U1.2
PD2
  Top 0.2: PS.TP 87.87,2.87 88.63,3.63 U$2.7 88.63,17.27 85.6,20.3 58.97,20.3 U1.3
PD3
  Top 0.2: RSTG.TP U$2.8 91.17,17.23 87.6,20.8 59.04,20.8 U1.4
PD4  (via drill 0.35)
  Top 0.2: U$2.9 93.71,3.67 94.51,2.87 U2RX.TP | U1.125 49.7,22.98 v49.7,19.8
  Bottom 0.2: v49.7,19.8 49.75,19.8 50.25,19.3 91.65,19.3 93.71,17.24 U$2.9
PD5  (via drill 0.35)
  Top 0.2: U$2.10 96.25,4.75 98.13,2.87 U2TX.TP | v50.5,20.8 50.5,23.21 U1.126
  Bottom 0.2: v50.5,20.8 50.5,20.3 51,19.8 93.65,19.8 96.3,17.15 96.3,6.9 U$2.10
PD7  (via drill 0.35)
  Top 0.2: U$2.11 98.79,5.91 101.83,2.87 NS.TP | U1.128 51.3,22.88 v51.3,21.8
  Bottom 0.2: v51.3,21.8 51.3,20.9 51.9,20.3 95.63,20.3 98.79,17.14 U$2.11
PE0
  Top 0.2: U$1.11 106.74,32.34 | 106.74,32.34 Y+.TP | U1.15 63.26,22.8 101,22.8 102.6,24.4 102.6,31.5 103.44,32.34 106.74,32.34
PE1
  Top 0.2: U$1.12 X+.TP 103.9,29.8 103.1,29 103.1,24.1 101.3,22.3 63.2,22.3 U1.14
PE2
  Top 0.2: U$1.13 106.74,27.26 Y-.TP 105.2,27.3 103.6,25.7 103.6,23.8 101.6,21.8 63.13,21.8 U1.13
PE3
  Top 0.2: U1.12 63.06,21.3 101.8,21.3 105.22,24.72 X-.TP U$1.14
PE4  (via drill 0.35)
  Top 0.2: U1.123 50,24.41 50,24.4 48.1,22.51 v48.1,17.8 | U2.1 41.53,14.03 42.2,14.7 61.8,14.7 64.2,17.1 MOSI1.TP
  Bottom 0.2: v48.1,17.8 48.1,16.6 46.2,14.7 42.2,14.7 41.53,14.03 U2.1
PE5  (via drill 0.35)
  Top 0.2: U2.3 36.45,14.35 37.8,15.7 55.2,15.7 56.6,17.1 CS1.TP | U1.124 48.9,22.75 v48.9,18.8
  Bottom 0.2: v48.9,18.8 48.1,18.8 47.4,18.1 47.4,16.8 45.8,15.2 37.3,15.2 36.45,14.35 U2.3
PK4
  Top 0.2: U1.63 56.5,45.05 56.5,52.2 57.15,52.85 U$3.3 SCL2.TP
PK5  (via drill 0.35)
  Top 0.2: U1.62 57,44.99 57,51.9 57.2,52.1 v58.8,52.1 | SDA2.TP U$3.4
  Bottom 0.2: U$3.4 66.5,55.4 65.9,54.8 65.9,53 65,52.1 v58.8,52.1
PP0  (via drill 0.35)
  Top 0.2: U1.118 52.36,29.6 v53.9,29.6
  Bottom 0.2: U6RX.TP 11.6,3.9 13,5.3 18.9,5.3 19.9,6.3 21.7,6.3 22.7,7.3 22.7,15.1 24.8,17.2 44.2,17.2 44.6,17.6 44.6,18.8 45.2,19.4 45.2,22.44 52.36,29.6 v53.9,29.6
PP1  (via drill 0.35)
  Top 0.2: U1.119 52.06,28.73 53.38,28.73 v53.4,28.71
  Bottom 0.2: U6TX.TP 18.4,3.9 20.2,5.7 21.8,5.7 23.2,7.1 23.2,14.9 25,16.7 44.6,16.7 45.3,17.4 45.3,18.6 45.9,19.2 45.9,22.58 52.05,28.73 53.38,28.73 v53.4,28.71
RBIAS
  Top 0.2: R1.2 U1.59 | U1.59
RST
  Top 0.2: R6.1 R7.1 C9.1 47.7,54 48.5,53.2 48.5,44.35 U1.70
SHUNT
  Top 0.254: R13.2 30.62,14.77 R12.1 30.42,12.22 IC1.1
SPKR+
  Top 0.254: U$2.3 78.47,6.07 77.7,5.3 71.3,5.3 70.33,4.33 SPKR.2
SPKR-
  Top 0.254: SPKR.1 72.87,3.87 73.8,4.8 80.1,4.8 81.01,5.71 U$2.4
TCK/SWCLK
  Top 0.2: U1.100 41.21,28.63 37.93,28.63 JTAG.1
TDI
  Top 0.2: U1.98 41.25,29.8 32.9,29.8 32.15,29.05 JTAG.3
TDO/SWO
  Top 0.2: U1.97 41.28,30.4 30.6,30.4 29.6,29.4 JTAG.4
TMS/SWDIO
  Top 0.2: U1.99 41.21,29.2 35.3,29.2 34.69,28.59 JTAG.2
VBAT
  Top 0.2: U1.68 50.55,43.43 C5.1 R5.2
VDDC  (via drill 0.35)
  Top 0.2: v50.1,29.8 50.1,29.04 U1.115 45.3,24.23 C6.1 | U1.87 47.1,36.13 v47.1,35.6 | VDDC.TP 37.44,24.23 41.07,24.23 41,24.3 C8.1 C7.1 C6.1 | C6.1
  Bottom 0.2: v47.1,35.6 46.1,34.6 46.1,33.8 v50.1,29.8
VREF
  Top 0.254: R12.2 30.18,9.68 IC1.2 | R11.1 R12.2 | U2.6 36.45,4.95 36,4.5 32.6,4.5 32.1,5 32.1,9.3 31.28,10.12 R12.2
VREFA+  (via drill 0.35)
  Top 0.2: R2.1 59.67,23.01 59.14,23.54 57.19,25.48 57.18,25.48 U1.9 v55.08,27.59
  Bottom 0.2: v55.08,27.59 54.88,27.79 54.88,28.59 57.39,31.1 58.38,31.1 VREFA.TP
WAKE
  Top 0.2: WAKE.TP 56,54.6 56,47.1 | U1.64 56,45.12 56,47.1 | R4.2 55.95,47.15 56,47.1
WAKEVDD
  Top 0.2: R4.1 52.6,49.05 R5.1 R3.2 53.6,51.4 53.97,51.77 3.3V.TP